# Altium schematic sheet DSP_GPIO&Digital.SchDoc
size A4
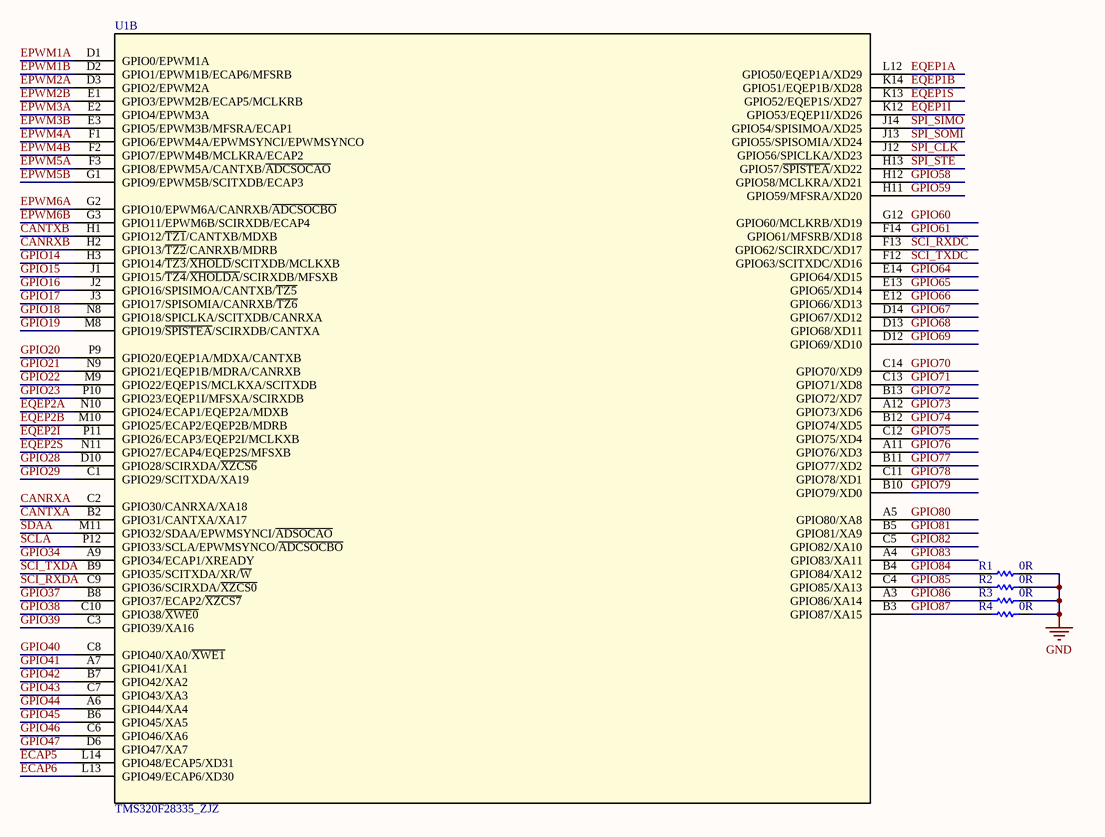
[diagram p0: DSP_GPIO&Digital.SchDoc]

## Parts
R1  value 0R  [r0603]  (hidden comment: Res1)
R2  value 0R  [r0603]  (hidden comment: Res1)
R3  value 0R  [r0603]  (hidden comment: Res1)
R4  value 0R  [r0603]  (hidden comment: Res1)
U1  TMS320F28335_ZJZ  [ZJZ176]  (part B of 3)

## Nets
GND: R1.1 R2.1 R3.1 R4.1
CANRXA: U1.C2(GPIO30/CANRXA/XA18)
CANRXB: U1.H2(GPIO13/~{TZ2}/CANRXB/MDRB)
CANTXA: U1.B2(GPIO31/CANTXA/XA17)
CANTXB: U1.H1(GPIO12/~{TZ1}/CANTXB/MDXB)
ECAP5: U1.L14(GPIO48/ECAP5/XD31)
ECAP6: U1.L13(GPIO49/ECAP6/XD30)
EPWM1A: U1.D1(GPIO0/EPWM1A)
EPWM1B: U1.D2(GPIO1/EPWM1B/ECAP6/MFSRB)
EPWM2A: U1.D3(GPIO2/EPWM2A)
EPWM2B: U1.E1(GPIO3/EPWM2B/ECAP5/MCLKRB)
EPWM3A: U1.E2(GPIO4/EPWM3A)
EPWM3B: U1.E3(GPIO5/EPWM3B/MFSRA/ECAP1)
EPWM4A: U1.F1(GPIO6/EPWM4A/EPWMSYNCI/EPWMSYNCO)
EPWM4B: U1.F2(GPIO7/EPWM4B/MCLKRA/ECAP2)
EPWM5A: U1.F3(GPIO8/EPWM5A/CANTXB/~{ADCSOCAO})
EPWM5B: U1.G1(GPIO9/EPWM5B/SCITXDB/ECAP3)
EPWM6A: U1.G2(GPIO10/EPWM6A/CANRXB/~{ADCSOCBO})
EPWM6B: U1.G3(GPIO11/EPWM6B/SCIRXDB/ECAP4)
EQEP1A: U1.L12(GPIO50/EQEP1A/XD29)
EQEP1B: U1.K14(GPIO51/EQEP1B/XD28)
EQEP1I: U1.K12(GPIO53/EQEP1I/XD26)
EQEP1S: U1.K13(GPIO52/EQEP1S/XD27)
EQEP2A: U1.N10(GPIO24/ECAP1/EQEP2A/MDXB)
EQEP2B: U1.M10(GPIO25/ECAP2/EQEP2B/MDRB)
EQEP2I: U1.P11(GPIO26/ECAP3/EQEP2I/MCLKXB)
EQEP2S: U1.N11(GPIO27/ECAP4/EQEP2S/MFSXB)
GPIO14: U1.H3(GPIO14/~{TZ3}/~{XHOLD}/SCITXDB/MCLKXB)
GPIO15: U1.J1(GPIO15/~{TZ4}/~{XHOLDA}/SCIRXDB/MFSXB)
GPIO16: U1.J2(GPIO16/SPISIMOA/CANTXB/~{TZ5})
GPIO17: U1.J3(GPIO17/SPISOMIA/CANRXB/~{TZ6})
GPIO18: U1.N8(GPIO18/SPICLKA/SCITXDB/CANRXA)
GPIO19: U1.M8(GPIO19/~{SPISTEA}/SCIRXDB/CANTXA)
GPIO20: U1.P9(GPIO20/EQEP1A/MDXA/CANTXB)
GPIO21: U1.N9(GPIO21/EQEP1B/MDRA/CANRXB)
GPIO22: U1.M9(GPIO22/EQEP1S/MCLKXA/SCITXDB)
GPIO23: U1.P10(GPIO23/EQEP1I/MFSXA/SCIRXDB)
GPIO28: U1.D10(GPIO28/SCIRXDA/~{XZCS6})
GPIO29: U1.C1(GPIO29/SCITXDA/XA19)
GPIO34: U1.A9(GPIO34/ECAP1/XREADY)
GPIO37: U1.B8(GPIO37/ECAP2/~{XZCS7})
GPIO38: U1.C10(GPIO38/~{XWE0})
GPIO39: U1.C3(GPIO39/XA16)
GPIO40: U1.C8(GPIO40/XA0/~{XWE1})
GPIO41: U1.A7(GPIO41/XA1)
GPIO42: U1.B7(GPIO42/XA2)
GPIO43: U1.C7(GPIO43/XA3)
GPIO44: U1.A6(GPIO44/XA4)
GPIO45: U1.B6(GPIO45/XA5)
GPIO46: U1.C6(GPIO46/XA6)
GPIO47: U1.D6(GPIO47/XA7)
GPIO58: U1.H12(GPIO58/MCLKRA/XD21)
GPIO59: U1.H11(GPIO59/MFSRA/XD20)
GPIO60: U1.G12(GPIO60/MCLKRB/XD19)
GPIO61: U1.F14(GPIO61/MFSRB/XD18)
GPIO64: U1.E14(GPIO64/XD15)
GPIO65: U1.E13(GPIO65/XD14)
GPIO66: U1.E12(GPIO66/XD13)
GPIO67: U1.D14(GPIO67/XD12)
GPIO68: U1.D13(GPIO68/XD11)
GPIO69: U1.D12(GPIO69/XD10)
GPIO70: U1.C14(GPIO70/XD9)
GPIO71: U1.C13(GPIO71/XD8)
GPIO72: U1.B13(GPIO72/XD7)
GPIO73: U1.A12(GPIO73/XD6)
GPIO74: U1.B12(GPIO74/XD5)
GPIO75: U1.C12(GPIO75/XD4)
GPIO76: U1.A11(GPIO76/XD3)
GPIO77: U1.B11(GPIO77/XD2)
GPIO78: U1.C11(GPIO78/XD1)
GPIO79: U1.B10(GPIO79/XD0)
GPIO80: U1.A5(GPIO80/XA8)
GPIO81: U1.B5(GPIO81/XA9)
GPIO82: U1.C5(GPIO82/XA10)
GPIO83: U1.A4(GPIO83/XA11)
GPIO84: R1.2 U1.B4(GPIO84/XA12)
GPIO85: R2.2 U1.C4(GPIO85/XA13)
GPIO86: R3.2 U1.A3(GPIO86/XA14)
GPIO87: R4.2 U1.B3(GPIO87/XA15)
SCI_RXDA: U1.C9(GPIO36/SCIRXDA/~{XZCS0})
SCI_RXDC: U1.F13(GPIO62/SCIRXDC/XD17)
SCI_TXDA: U1.B9(GPIO35/SCITXDA/XR/~{W})
SCI_TXDC: U1.F12(GPIO63/SCITXDC/XD16)
SCLA: U1.P12(GPIO33/SCLA/EPWMSYNCO/~{ADCSOCBO})
SDAA: U1.M11(GPIO32/SDAA/EPWMSYNCI/~{ADSOCAO})
SPI_CLK: U1.J12(GPIO56/SPICLKA/XD23)
SPI_SIMO: U1.J14(GPIO54/SPISIMOA/XD25)
SPI_SOMI: U1.J13(GPIO55/SPISOMIA/XD24)
SPI_STE: U1.H13(GPIO57/~{SPISTEA}/XD22)

## Library data of the parts
R1-R4 = Res1: Resistor; Published: 8-Jun-2000; LatestRevisionDate: 17-Jul-2002; LatestRevisionNote: Re-released for DXP Platform.; PackageReference: AXIAL-0.3; Publisher: Altium Limited; PackageDescription: Axial Device, Thru-Hole; 2 Leads; 0.3 in Pin Spacing
U1 = TMS320F28335_ZJZ: Imported; Manufacturer: Texas Instruments; Manufacturer_Part_Number: tms320f28335_zjz_176; INDUSTRY_STD_PKG_TYPE: BGA; FAMILY_NAME: 28X DELFINO&#153; FLOATING-POINT SERIES; PIN_COUNT: 176; PACKAGE_DESIGNATOR: ZJZ; Vendor: Texas Instuments; Datasheet_URL: http://www.ti.com/lit/gpn/TMS320F28335; GENERIC_PART_NUMBER: TMS320F28335; Value: Value; Type: Type; RefDes: RefDes